# Altium schematic sheet FOC Drive.SchDoc
size A2; Organization: Altium Limited; Address1: L3, 12a Rodborough Rd; Address2: Frenchs Forest; Address3: NSW; Address4: Australia 2086
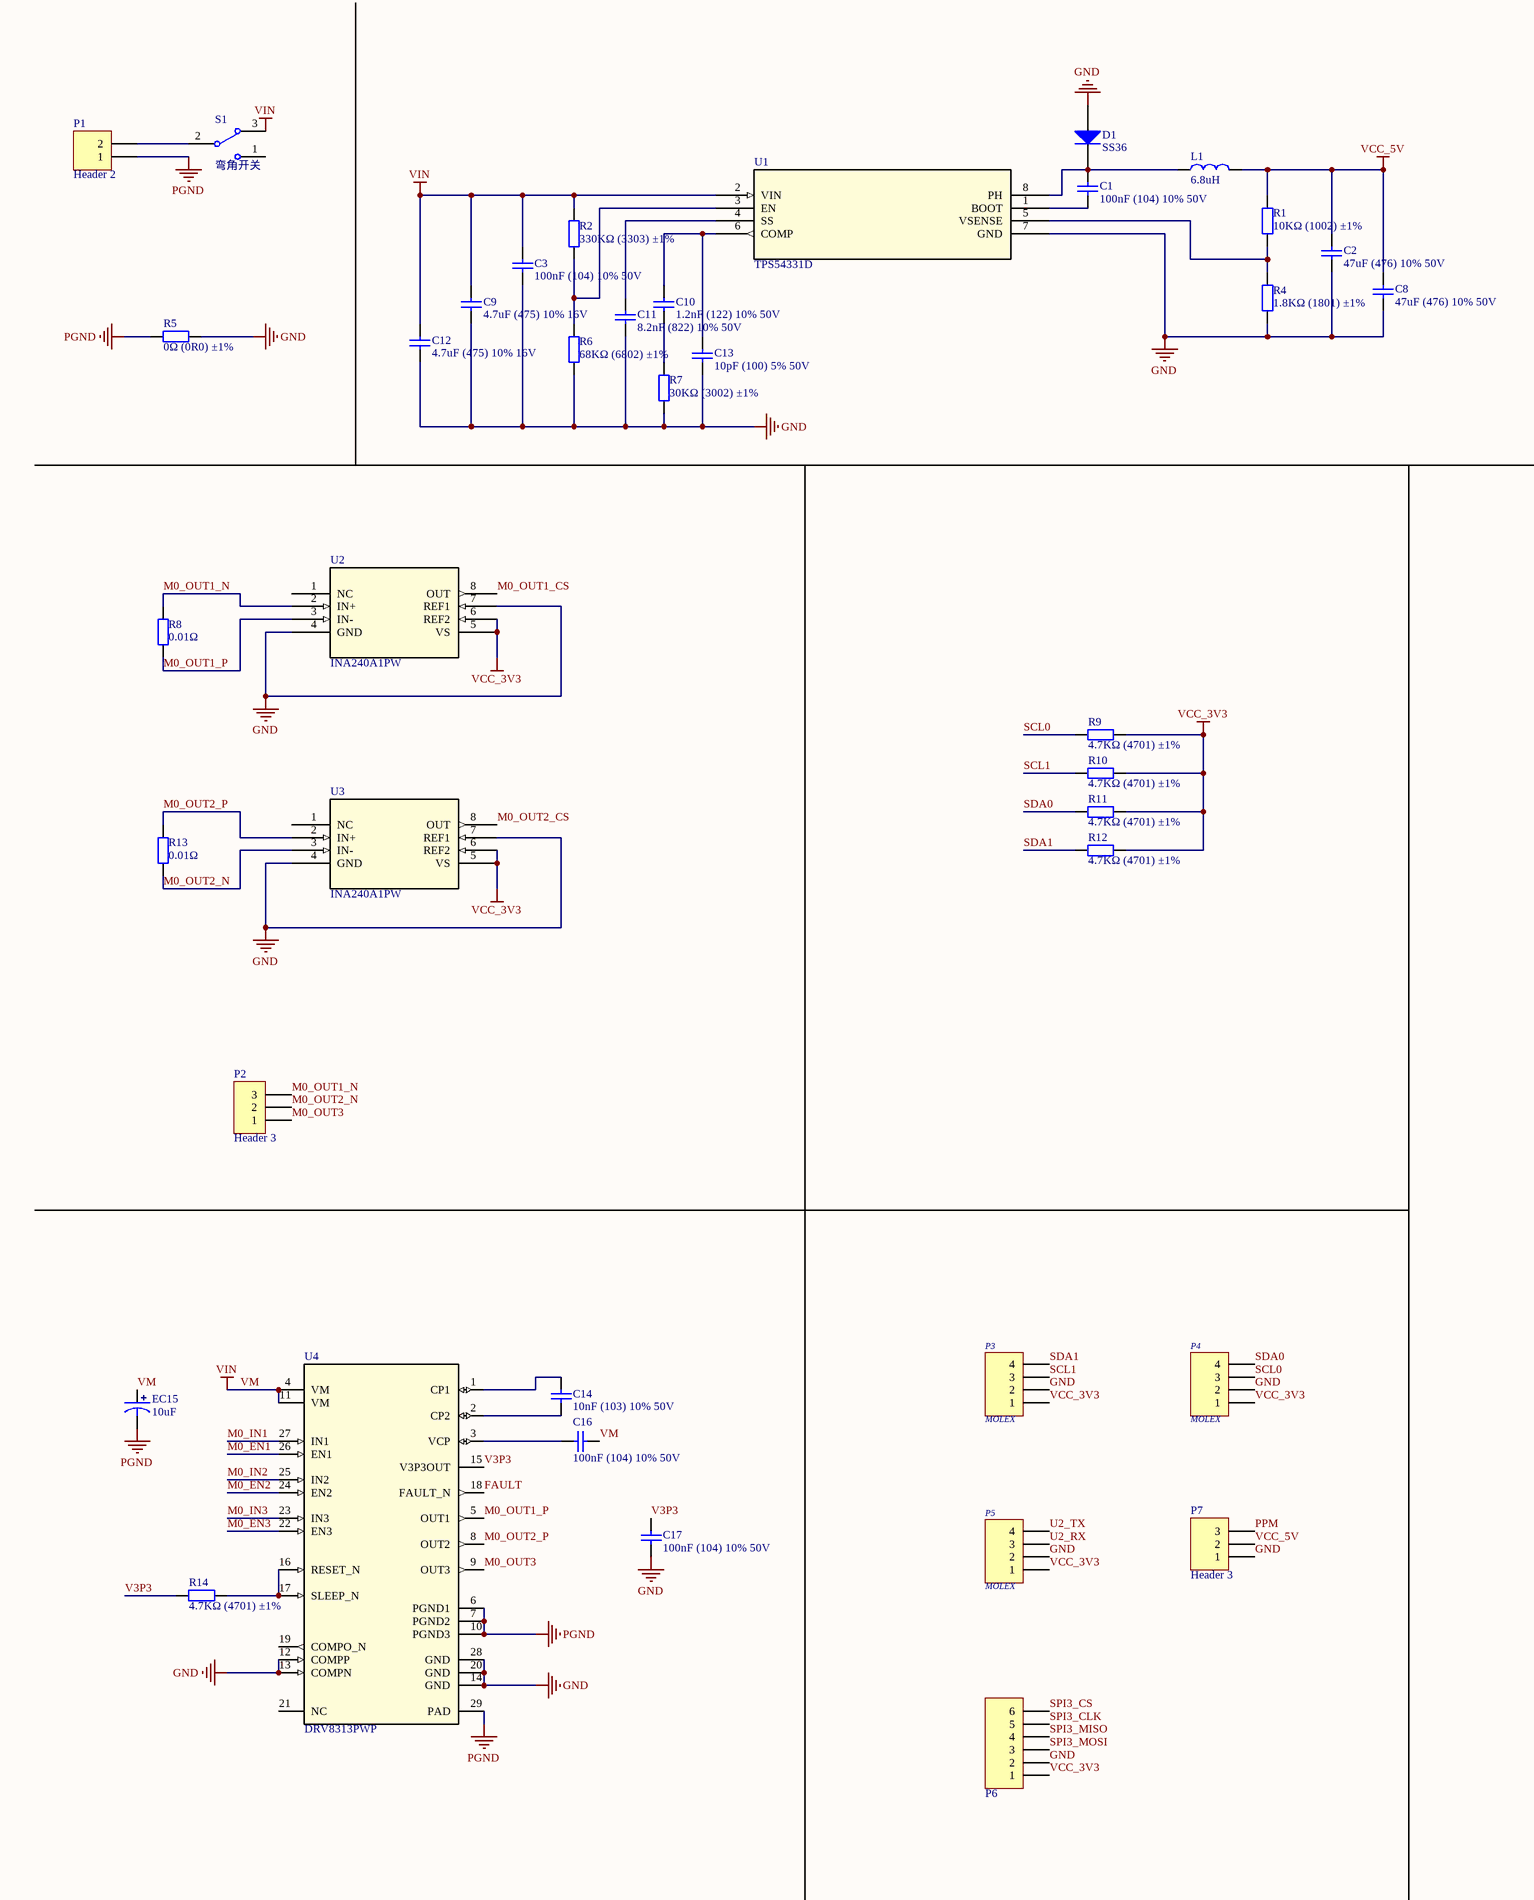
[diagram p0: FOC Drive.SchDoc, left]
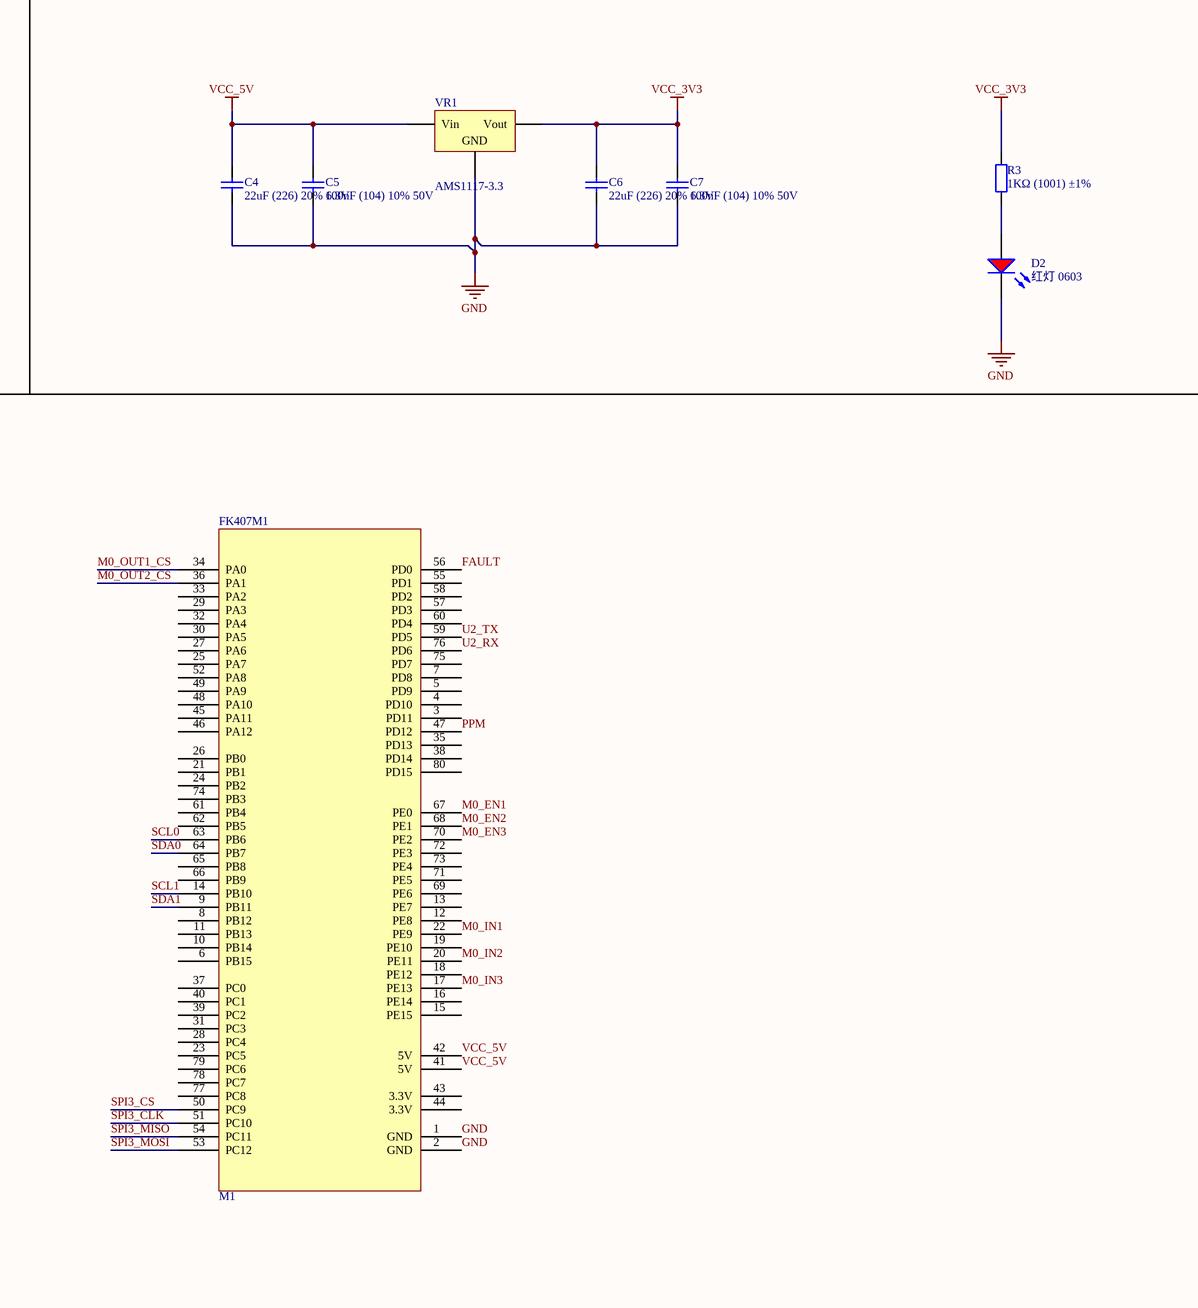
[diagram p1: FOC Drive.SchDoc, right]

## Parts
C1  100nF (104) 10% 50V  [0603_C]
C2  47uF (476) 10% 50V  [0603_C]
C3  100nF (104) 10% 50V  [0603_C]
C4  22uF (226) 20% 6.3V  [0603_C]
C5  100nF (104) 10% 50V  [0603_C]
C6  22uF (226) 20% 6.3V  [0603_C]
C7  100nF (104) 10% 50V  [0603_C]
C8  47uF (476) 10% 50V  [0603_C]
C9  4.7uF (475) 10% 16V  [0603_C]
C10  1.2nF (122) 10% 50V  [0603_C]
C11  8.2nF (822) 10% 50V  [0603_C]
C12  4.7uF (475) 10% 16V  [0603_C]
C13  10pF (100) 5% 50V  [0603_C]
C14  10nF (103) 10% 50V  [0603_C]
C16  100nF (104) 10% 50V  [0603_C]
C17  100nF (104) 10% 50V  [0603_C]
D1  SS36  [SMA(DO-214AC)_S5]
D2  红灯 0603  [0603_LED_S1]
EC15  10uF  [SMD-EC5.0X5.3X5.4]
FK407M1  M1  [FK407M1]
L1  6.8uH  [IND-SMD_L5.0-W5.0_SWPA5040S]
P1  Header 2  [KF127-2P-5mm]
P2  Header 3  [KF127-3P-5mm]
P3  MOLEX  [SH1.0-4P-L]
P4  MOLEX  [SH1.0-4P-L]
P5  MOLEX  [SH1.0-4P-L]
P6  SH_6P  [SH1.0-6P-L]  (value not drawn)
P7  Header 3  [HDR1X3]
R1  10KΩ (1002) ±1%  [0603_R]
R2  330KΩ (3303) ±1%  [0603_R]
R3  1KΩ (1001) ±1%  [0603_R]
R4  1.8KΩ (1801) ±1%  [0603_R]
R5  0Ω (0R0) ±1%  [0805_R]
R6  68KΩ (6802) ±1%  [0603_R]
R7  30KΩ (3002) ±1%  [0603_R]
R8  0.01Ω  [1206_R]
R9  4.7KΩ (4701) ±1%  [0603_R]
R10  4.7KΩ (4701) ±1%  [0603_R]
R11  4.7KΩ (4701) ±1%  [0603_R]
R12  4.7KΩ (4701) ±1%  [0603_R]
R13  0.01Ω  [1206_R]
R14  4.7KΩ (4701) ±1%  [0603_R]
S1  弯角开关  [SS-12F23]
U1  TPS54331D  [D8-M]
U2  INA240A1PW  [PW0008A_N_TEX]
U3  INA240A1PW  [PW0008A_N_TEX]
U4  DRV8313PWP  [PWP0028F_N]
VR1  AMS1117-3.3  [SOT-223]

## Nets
GND: C2.1 C3.1 C4.1 C5.1 C6.1 C7.1 C8.1 C9.1 C11.1 C12.1 C13.1 C17.1 D1.1(A) D2.K FK407M1.1(GND) FK407M1.2(GND) P3.2 P4.2 P5.2 P6.2 P7.1 R4.1 R5.2 R6.1 R7.1 U1.7(GND) U2.4(GND) U2.7(REF1) U3.4(GND) U3.7(REF1) U4.12(COMPP) U4.13(COMPN) U4.14(GND) U4.20(GND) U4.28(GND) VR1.1(GND)
PGND: EC15.2 P1.1 R5.1 U4.6(PGND1) U4.7(PGND2) U4.10(PGND3) U4.29(PAD)
VCC_3V3: C6.2 C7.2 P3.1 P4.1 P5.1 P6.1 R3.2 R9.2 R10.2 R11.2 R12.2 U2.5(VS) U2.6(REF2) U3.5(VS) U3.6(REF2) VR1.2(Vout)
VCC_5V: C2.2 C4.2 C5.2 C8.2 FK407M1.41(5V) FK407M1.42(5V) L1.1 P7.2 R1.2 VR1.3(Vin)
VM: C3.2 C9.2 C12.2 C16.1 EC15.1 R2.2 S1.3 U1.2(VIN) U4.4(VM) U4.11(VM)  [also labelled VIN]
FAULT: FK407M1.56(PD0) U4.18(FAULT_N)
M0_EN1: FK407M1.67(PE0) U4.26(EN1)
M0_EN2: FK407M1.68(PE1) U4.24(EN2)
M0_EN3: FK407M1.70(PE2) U4.22(EN3)
M0_IN1: FK407M1.22(PE9) U4.27(IN1)
M0_IN2: FK407M1.20(PE11) U4.25(IN2)
M0_IN3: FK407M1.17(PE13) U4.23(IN3)
M0_OUT1_CS: FK407M1.34(PA0) U2.8(OUT)
M0_OUT1_N: P2.3 R8.2 U2.2(IN+)
M0_OUT1_P: R8.1 U2.3(IN-) U4.5(OUT1)
M0_OUT2_CS: FK407M1.36(PA1) U3.8(OUT)
M0_OUT2_N: P2.2 R13.1 U3.3(IN-)
M0_OUT2_P: R13.2 U3.2(IN+) U4.8(OUT2)
M0_OUT3: P2.1 U4.9(OUT3)
PPM: FK407M1.47(PD12) P7.3
SCL0: FK407M1.63(PB6) P4.3 R9.1
SCL1: FK407M1.14(PB10) P3.3 R10.1
SDA0: FK407M1.64(PB7) P4.4 R11.1
SDA1: FK407M1.9(PB11) P3.4 R12.1
SPI3_CLK: FK407M1.51(PC10) P6.5
SPI3_CS: FK407M1.50(PC9) P6.6
SPI3_MISO: FK407M1.54(PC11) P6.4
SPI3_MOSI: FK407M1.53(PC12) P6.3
U2_RX: FK407M1.76(PD6) P5.3
U2_TX: FK407M1.59(PD5) P5.4
V3P3: C17.2 R14.1 U4.15(V3P3OUT)
NetC1_1: C1.1 U1.1(BOOT)
NetC1_2: C1.2 D1.2(K) L1.2 U1.8(PH)
NetC10_1: C10.1 R7.2
NetC10_2: C10.2 C13.2 U1.6(COMP)
NetC11_2: C11.2 U1.4(SS)
NetC14_1: C14.1 U4.2(CP2)
NetC14_2: C14.2 U4.1(CP1)
NetC16_2: C16.2 U4.3(VCP)
NetD2_A: D2.A R3.1
NetP1_2: P1.2 S1.2
NetR1_1: R1.1 R4.2 U1.5(VSENSE)
NetR2_1: R2.1 R6.2 U1.3(EN)
NetR14_2: R14.2 U4.16(RESET_N) U4.17(SLEEP_N)

Not connected (* = marked no-connect by the designer): FK407M1 3(PD11) 4(PD10) 5(PD9) 6(PB15) 7(PD8) 8(PB12) 10(PB14) 11(PB13) 12(PE8) 13(PE7) 15(PE15) 16(PE14) 18(PE12) 19(PE10) 21(PB1) 23(PC5) 24(PB2) 25(PA7) 26(PB0) 27(PA6) 28(PC4) 29(PA3) 30(PA5) 31(PC3) 32(PA4) 33(PA2) 35(PD13) 37(PC0) 38(PD14) 39(PC2) 40(PC1) 43(3.3V) 44(3.3V) 45(PA11) 46(PA12) 48(PA10) 49(PA9) 52(PA8) 55(PD1) 57(PD3) 58(PD2) 60(PD4) 61(PB4) 62(PB5) 65(PB8) 66(PB9) 69(PE6) 71(PE5) 72(PE3) 73(PE4) 74(PB3) 75(PD7) 77(PC8) 78(PC7) 79(PC6) 80(PD15); S1 1; U2 1(NC); U3 1(NC); U4 19(COMPO_N) 21(NC)

## Notes on the sheet
- Title
- Size:
- Date:
- File:
- A2
- Number:
- Time:
- Revision:
- Sheet
- of

## Library data of the parts
C1 C3 C5 C7 C16 C17 = 0603 100nF (104) 10% 50V: 贴片电容; ComponentLink1Description: 供应商链接; ComponentLink1URL: http://www.szlcsc.com/product/details_15331.html; Package: 0603; Supplier: LC; SuppliersPartNumber: C14663
C2 C8 = 0603 47nF (473) 10% 50V: 贴片电容; ComponentLink1Description: 供应商链接; ComponentLink1URL: http://www.szlcsc.com/product/details_1974.html; Package: 0603; Supplier: LC; SuppliersPartNumber: C1622
C4 C6 = 0603 22uF (226) 20% 6.3V: 贴片电容; ComponentLink1Description: 供应商链接; ComponentLink1URL: http://www.szlcsc.com/product/details_60514.html; Package: 0603; Supplier: LC; SuppliersPartNumber: C59461
C9 C12 = 0603 4.7uF (475) 10% 16V: 贴片电容; ComponentLink1Description: 供应商链接; ComponentLink1URL: http://www.szlcsc.com/product/details_20375.html; Package: 0603; Supplier: LC; SuppliersPartNumber: C19666
C10 = 0603 1.2nF (122) 10% 50V: 贴片电容; ComponentLink1Description: 供应商链接; ComponentLink1URL: http://www.szlcsc.com/product/details_31372.html; Package: 0603; Supplier: LC; SuppliersPartNumber: C30615
C11 = 0603 8.2nF (822) 10% 50V: 贴片电容; ComponentLink1Description: 供应商链接; ComponentLink1URL: http://www.szlcsc.com/product/details_28670.html; Package: 0603; Supplier: LC; SuppliersPartNumber: C27920
C13 = 0603 10pF (100) 5% 50V: 贴片电容; ComponentLink1Description: 供应商链接; ComponentLink1URL: http://www.szlcsc.com/product/details_1986.html; Package: 0603; Supplier: LC; SuppliersPartNumber: C1634
C14 = 0603 10nF (103) 10% 50V: 贴片电容; ComponentLink1Description: 供应商链接; ComponentLink1URL: http://www.szlcsc.com/product/details_58143.html; Package: 0603; Supplier: LC; SuppliersPartNumber: C57112
D1 = SMA(DO-214AC) US1M: 二极管; ComponentLink1Description: 供应商链接; ComponentLink1URL: http://www.szlcsc.com/product/details_5885.html; Package: SMA(DO-214AC); Supplier: LC; SuppliersPartNumber: C5441
D2 = 0603 红灯: 发光二极管; ComponentLink1Description: 供应商链接; ComponentLink1URL: http://www.szlcsc.com/product/details_2659.html; Package: 0603; Supplier: LC; SuppliersPartNumber: C2286
EC15 = SMD_ECAP: 贴片电解电容
FK407M1 = FK407M1
L1 = L: 5040
P1 = Header 2 5mm: Header, 2-Pin; LatestRevisionDate: 17-Jul-2002; LatestRevisionNote: Re-released for DXP Platform.; Publisher: Altium Limited
P2 P7 = Header 3: Header, 3-Pin; LatestRevisionDate: 17-Jul-2002; LatestRevisionNote: Re-released for DXP Platform.; Publisher: Altium Limited
P3-P5 = SH_4P: LatestRevisionDate: 17-Jul-2002; LatestRevisionNote: Re-released for DXP Platform.; Publisher: Altium Limited
P6 = SH_6P: Header, 6-Pin; LatestRevisionDate: 17-Jul-2002; LatestRevisionNote: Re-released for DXP Platform.; Publisher: Altium Limited
R1 = 0603 10KΩ (1002) 1%: 贴片电阻; ComponentLink1Description: 供应商链接; ComponentLink1URL: http://www.szlcsc.com/product/details_26547.html; Package: 0603; Supplier: LC; SuppliersPartNumber: C25804
R2 = 0603 330KΩ (3303) 1%: 贴片电阻; ComponentLink1Description: 供应商链接; ComponentLink1URL: http://www.szlcsc.com/product/details_23864.html; Package: 0603; Supplier: LC; SuppliersPartNumber: C23137
R3 = 0603 1KΩ (1001) 1%: 贴片电阻; ComponentLink1Description: 供应商链接; ComponentLink1URL: http://www.szlcsc.com/product/details_21904.html; Package: 0603; Supplier: LC; SuppliersPartNumber: C21190
R4 = 0603 1.8KΩ (1801) 1%: 贴片电阻; ComponentLink1Description: 供应商链接; ComponentLink1URL: http://www.szlcsc.com/product/details_4584.html; Package: 0603; Supplier: LC; SuppliersPartNumber: C4177
R5 = 0805 0Ω (0R0) 1%: 贴片电阻; ComponentLink1Description: 供应商链接; ComponentLink1URL: http://www.szlcsc.com/product/details_18165.html; Package: 0805; Supplier: LC; SuppliersPartNumber: C17477
R6 = 0603 68KΩ (6802) 1%: 贴片电阻; ComponentLink1Description: 供应商链接; ComponentLink1URL: http://www.szlcsc.com/product/details_23958.html; Package: 0603; Supplier: LC; SuppliersPartNumber: C23231
R7 = 0603 30KΩ (3002) 1%: 贴片电阻; ComponentLink1Description: 供应商链接; ComponentLink1URL: http://www.szlcsc.com/product/details_23711.html; Package: 0603; Supplier: LC; SuppliersPartNumber: C22984
R8 R13 = 1206 0Ω (0R0) 1%: 贴片电阻; ComponentLink1Description: 供应商链接; ComponentLink1URL: http://www.szlcsc.com/product/details_18576.html; Package: 1206; Supplier: LC; SuppliersPartNumber: C17888
R9-R12 R14 = 0603 4.7KΩ (4701) 1%: 贴片电阻; ComponentLink1Description: 供应商链接; ComponentLink1URL: http://www.szlcsc.com/product/details_23889.html; Package: 0603; Supplier: LC; SuppliersPartNumber: C23162
S1 = SS-12F23
U1 = TPS54331D: No Description Available; Mfr_Name: Texas Instruments; Copyright: Copyright (C) 2022 Ultra Librarian. All rights reserved.; Manufacturer_Part_Number: TPS54331D; RefDes: RefDes; Type: DEV
U2 U3 = INA240A1PW: No Description Available; Mfr_Name: Texas Instruments; Copyright: Copyright (C) 2022 Ultra Librarian. All rights reserved.; Manufacturer_Part_Number: INA240A1PW; RefDes: RefDes; Type: DEV
U4 = DRV8313PWP: No Description Available; Mfr_Name: Texas Instruments; Type: DEV; RefDes: RefDes; Copyright: Copyright (C) 2022 Ultra Librarian. All rights reserved.; Manufacturer_Part_Number: DRV8313PWP
VR1 = SOT-223 AMS1117-3.3: 低压差线性稳压(LDO); ComponentLink1Description: 供应商链接; ComponentLink1URL: http://www.szlcsc.com/product/details_6652.html; Package: SOT-223; Supplier: LC; SuppliersPartNumber: C6186